# Altium schematic sheet exam01.SchDoc
size A3
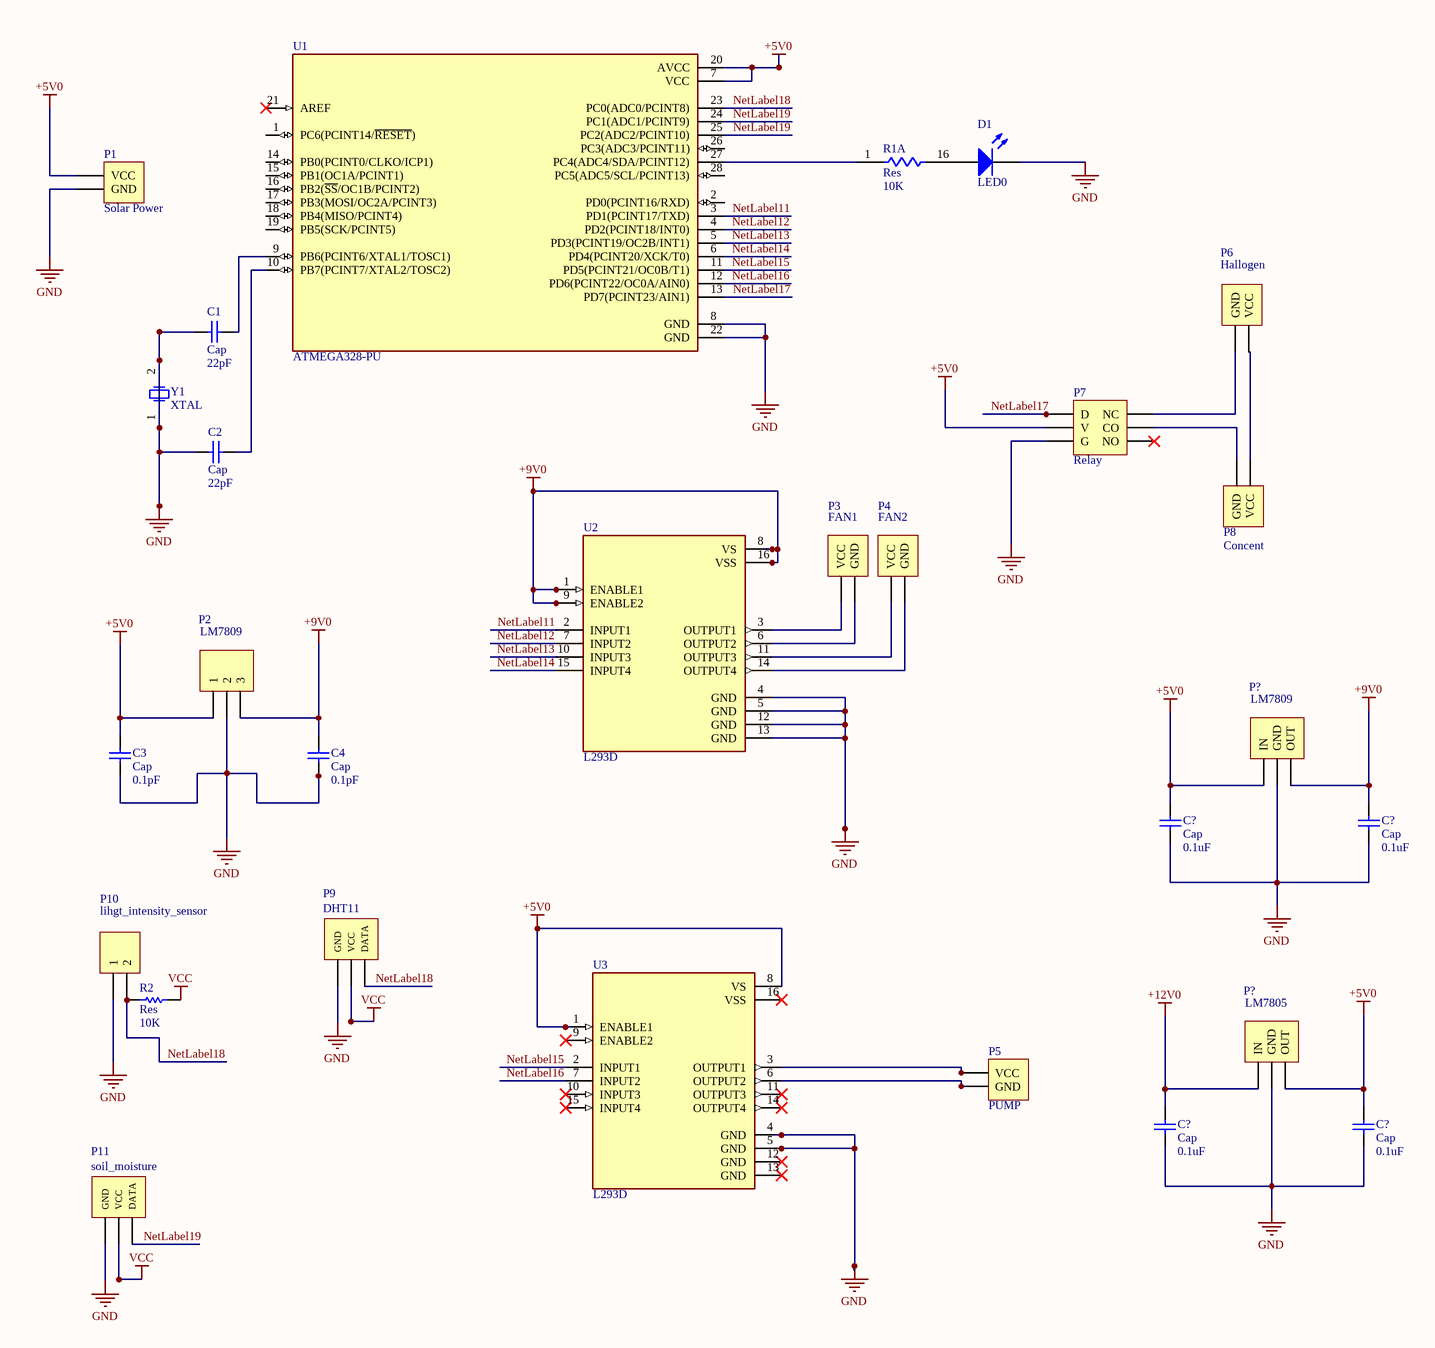
[diagram p0: exam01.SchDoc]

## Parts
(Parts that share a designator on the sheet are numbered #1, #2 ... from top to bottom, then left to right.)
C1  Cap  value 22pF  [RAD-0.3]
C2  Cap  value 22pF  [RAD-0.3]
C3  Cap  value 0.1pF  [RAD-0.3]
C4  Cap  value 0.1pF  [RAD-0.3]
C?#1  Cap  value 0.1uF  [RAD-0.3]
C?#2  Cap  value 0.1uF  [RAD-0.3]
C?#3  Cap  value 0.1uF  [RAD-0.3]
C?#4  Cap  value 0.1uF  [RAD-0.3]
D1  LED0  [LED-0]
P1  Solar Power  [HDR1X2H]
P2  LM7809  [HDR1X3]
P3  FAN1  [HDR1X2H]
P4  FAN2  [HDR1X2H]
P5  PUMP  [HDR1X2H]
P6  Hallogen  [HDR1X2H]
P7  Relay  [HDR2X3_CEN]
P8  Concent  [HDR1X2H]
P9  DHT11  [HDR1X3H]
P10  lihgt_intensity_sensor  [HDR1X2]
P11  soil_moisture  [HDR1X3H]
P?#1  LM7809  [HDR1X3]
P?#2  LM7805  [HDR1X3]
R1  Res  value 10K  [SOIC16_N]  (part A of 8)
R2  Res  value 10K  [AXIAL-0.5]
U1  ATMEGA328-PU  [DIP787W46P254L3467H508Q28]
U2  L293D  [DIP880W50P254L2000H510Q16]
U3  L293D  [DIP880W50P254L2000H510Q16]
Y1  XTAL  [R38]

## Nets
+5V0: C3.2 C?#1.2 C?#4.2 P1.1(VCC) P2.1 P7.2(V) P?#1.1(IN) P?#2.3(OUT) U1.7(VCC) U1.20(AVCC) U3.1(ENABLE1) U3.8(VS)
+9V0: C4.2 C?#2.2 P2.3 P?#1.3(OUT) U2.1(ENABLE1) U2.8(VS) U2.9(ENABLE2) U2.16(VSS)
+12V0: C?#3.2 P?#2.1(IN)
GND: C1.1 C2.1 C3.1 C4.1 C?#1.1 C?#2.1 C?#3.1 C?#4.1 D1.2(K) P1.2(GND) P2.2 P7.3(G) P9.1(GND) P10.1 P11.1(GND) P?#1.2(GND) P?#2.2(GND) U1.8(GND) U1.22(GND) U2.4(GND) U2.5(GND) U2.12(GND) U2.13(GND) U3.4(GND) U3.5(GND) Y1.1(OSC1) Y1.2(OSC2)
VCC: P9.2(VCC) P11.2(VCC) R2.2
NetLabel11: U1.3(PD1(PCINT17/TXD)) U2.2(INPUT1)
NetLabel12: U1.4(PD2(PCINT18/INT0)) U2.7(INPUT2)
NetLabel13: U1.5(PD3(PCINT19/OC2B/INT1)) U2.10(INPUT3)
NetLabel14: U1.6(PD4(PCINT20/XCK/T0)) U2.15(INPUT4)
NetLabel15: U1.11(PD5(PCINT21/OC0B/T1)) U3.2(INPUT1)
NetLabel16: U1.12(PD6(PCINT22/OC0A/AIN0)) U3.7(INPUT2)
NetLabel17: P7.1(D) U1.13(PD7(PCINT23/AIN1))
NetLabel18: P9.3(DATA) P10.2 R2.1 U1.23(PC0(ADC0/PCINT8))
NetLabel19: P11.3(DATA) U1.24(PC1(ADC1/PCINT9)) U1.25(PC2(ADC2/PCINT10))
NetC1_2: C1.2 U1.9(PB6(PCINT6/XTAL1/TOSC1))
NetC2_2: C2.2 U1.10(PB7(PCINT7/XTAL2/TOSC2))
NetD1_1: D1.1(A) R1.16
NetP3_1: P3.1(VCC) U2.3(OUTPUT1)
NetP3_2: P3.2(GND) U2.6(OUTPUT2)
NetP4_1: P4.1(VCC) U2.11(OUTPUT3)
NetP4_2: P4.2(GND) U2.14(OUTPUT4)
NetP5_1: P5.1(VCC) U3.3(OUTPUT1)
NetP5_2: P5.2(GND) U3.6(OUTPUT2)
NetP6_1: P6.1(GND) P7.4(NC)
NetP6_2: P6.2(VCC) P8.1(VCC)
NetP7_5: P7.5(CO) P8.2(GND)
NetR1_1: R1.1 U1.27(PC4(ADC4/SDA/PCINT12))

Not connected (* = marked no-connect by the designer): P7 6(NO)*; U1 1(PC6(PCINT14/~{RESET})) 2(PD0(PCINT16/RXD)) 14(PB0(PCINT0/CLKO/ICP1)) 15(PB1(OC1A/PCINT1)) 16(PB2(~{SS}/OC1B/PCINT2)) 17(PB3(MOSI/OC2A/PCINT3)) 18(PB4(MISO/PCINT4)) 19(PB5(SCK/PCINT5)) 21(AREF)* 26(PC3(ADC3/PCINT11)) 28(PC5(ADC5/SCL/PCINT13)); U3 9(ENABLE2)* 10(INPUT3)* 11(OUTPUT3)* 12(GND)* 13(GND)* 14(OUTPUT4)* 15(INPUT4)* 16(VSS)*

## Notes on the sheet
- Title
- Size:
- Date:
- A3
- Number:
- Time:
- Revision:
- Sheet
- of
- File:

## Library data of the parts
C1-C4 C?#1-C?#4 = Cap: Capacitor; Published: 8-Jun-2000; LatestRevisionDate: 17-Jul-2002; LatestRevisionNote: Re-released for DXP Platform.; PackageReference: RAD-0.3; Publisher: Altium Limited; PackageDescription: Radial Cap, Thru-Hole; 2 Leads; 0.3 in Pin Spacing
D1 = LED0: Typical INFRARED GaAs LED; Published: 8-Jun-2000; LatestRevisionDate: 08-Jul-2005; LatestRevisionNote: Mech Layer 1 removed.; PackageReference: LED-0; Publisher: Altium Limited; PackageDescription: LED; 2 Leads
P1 P3-P6 P8 = Header 2H: Header, 2-Pin, Right Angle; LatestRevisionDate: 17-Jul-2002; LatestRevisionNote: Re-released for DXP Platform.; Publisher: Altium Limited
P2 P?#1 P?#2 = Header 3: Header, 3-Pin; LatestRevisionDate: 17-Jul-2002; LatestRevisionNote: Re-released for DXP Platform.; Publisher: Altium Limited
P7 = Header 3X2A: Header, 3-Pin, Dual row; LatestRevisionDate: 17-Jul-2002; LatestRevisionNote: Re-released for DXP Platform.; Publisher: Altium Limited
P9 P11 = Header 3H: Header, 3-Pin, Right Angle; LatestRevisionDate: 17-Jul-2002; LatestRevisionNote: Re-released for DXP Platform.; Publisher: Altium Limited
P10 = Header 2: Header, 2-Pin; LatestRevisionDate: 17-Jul-2002; LatestRevisionNote: Re-released for DXP Platform.; Publisher: Altium Limited
R1 = Res Pack1: Isolated Resistor Network - Parts; Sim Note: Enter the Resistance value into parameter field.; Published: 24-Mar-1999; LatestRevisionDate: 29-May-2009; LatestRevisionNote: IPC-7351 Footprint Added.; PackageReference: SOIC16; Publisher: Altium Limited; PackageDescription: 16-Pin Small Outline Integrated Circuit 1.27 mm Pitch; Code_JEDEC: MS-012-AC; Code_IPC: SOIC127P600-16
R2 = Res Semi: Semiconductor Resistor; Published: 8-Jun-2000; LatestRevisionDate: 17-Jul-2002; LatestRevisionNote: Re-released for DXP Platform.; PackageReference: AXIAL-0.5; Publisher: Altium Limited; PackageDescription: Axial Device, Thru-Hole; 2 Leads; 0.5 in Pin Spacing
U1 = ATMEGA328-PU: AVR AVRÂ® ATmega Microcontroller IC 8-Bit 20MHz 32KB (16K x 16) FLASH 28-PDIP; MF: Microchip; Availability: In Stock; MP: ATMEGA328-PU; SnapEDA_Link: https://www.snapeda.com/parts/ATMEGA328-PU/Microchip/view-part/?ref=snap; Value: *; Price: None; Purchase-URL: https://pricing.snapeda.com/search/part/ATMEGA328-PU/?ref=eda; Check_prices: https://www.snapeda.com/parts/ATMEGA328-PU/Microchip/view-part/?ref=eda; Package: DIP-28 Microchip Technology
U2 U3 = L293D: Bipolar Motor Driver - Parallel 16-PowerDIP; MF: STMicroelectronics; MP: L293D; Package: DIP-16 STMicroelectronics; SnapEDA_Link: https://www.snapeda.com/parts/L293D/STMicroelectronics/view-part/?ref=snap; Purchase-URL: https://pricing.snapeda.com/search/part/L293D/?ref=eda; Check_prices: https://www.snapeda.com/parts/L293D/STMicroelectronics/view-part/?ref=eda; Availability: In Stock; Value: *; Price: None
Y1 = XTAL: Crystal Oscillator; Published: 8-Jun-2000; LatestRevisionDate: 17-Jul-2002; LatestRevisionNote: Re-released for DXP Platform.; PackageReference: R38; Publisher: Altium Limited; PackageDescription: Crystal, Thru-Hole; 2 Leads; Body 3.1 x 8.2 mm (Dia.xH)